# Altium project Humidity_Fan_Control.PrjPcb
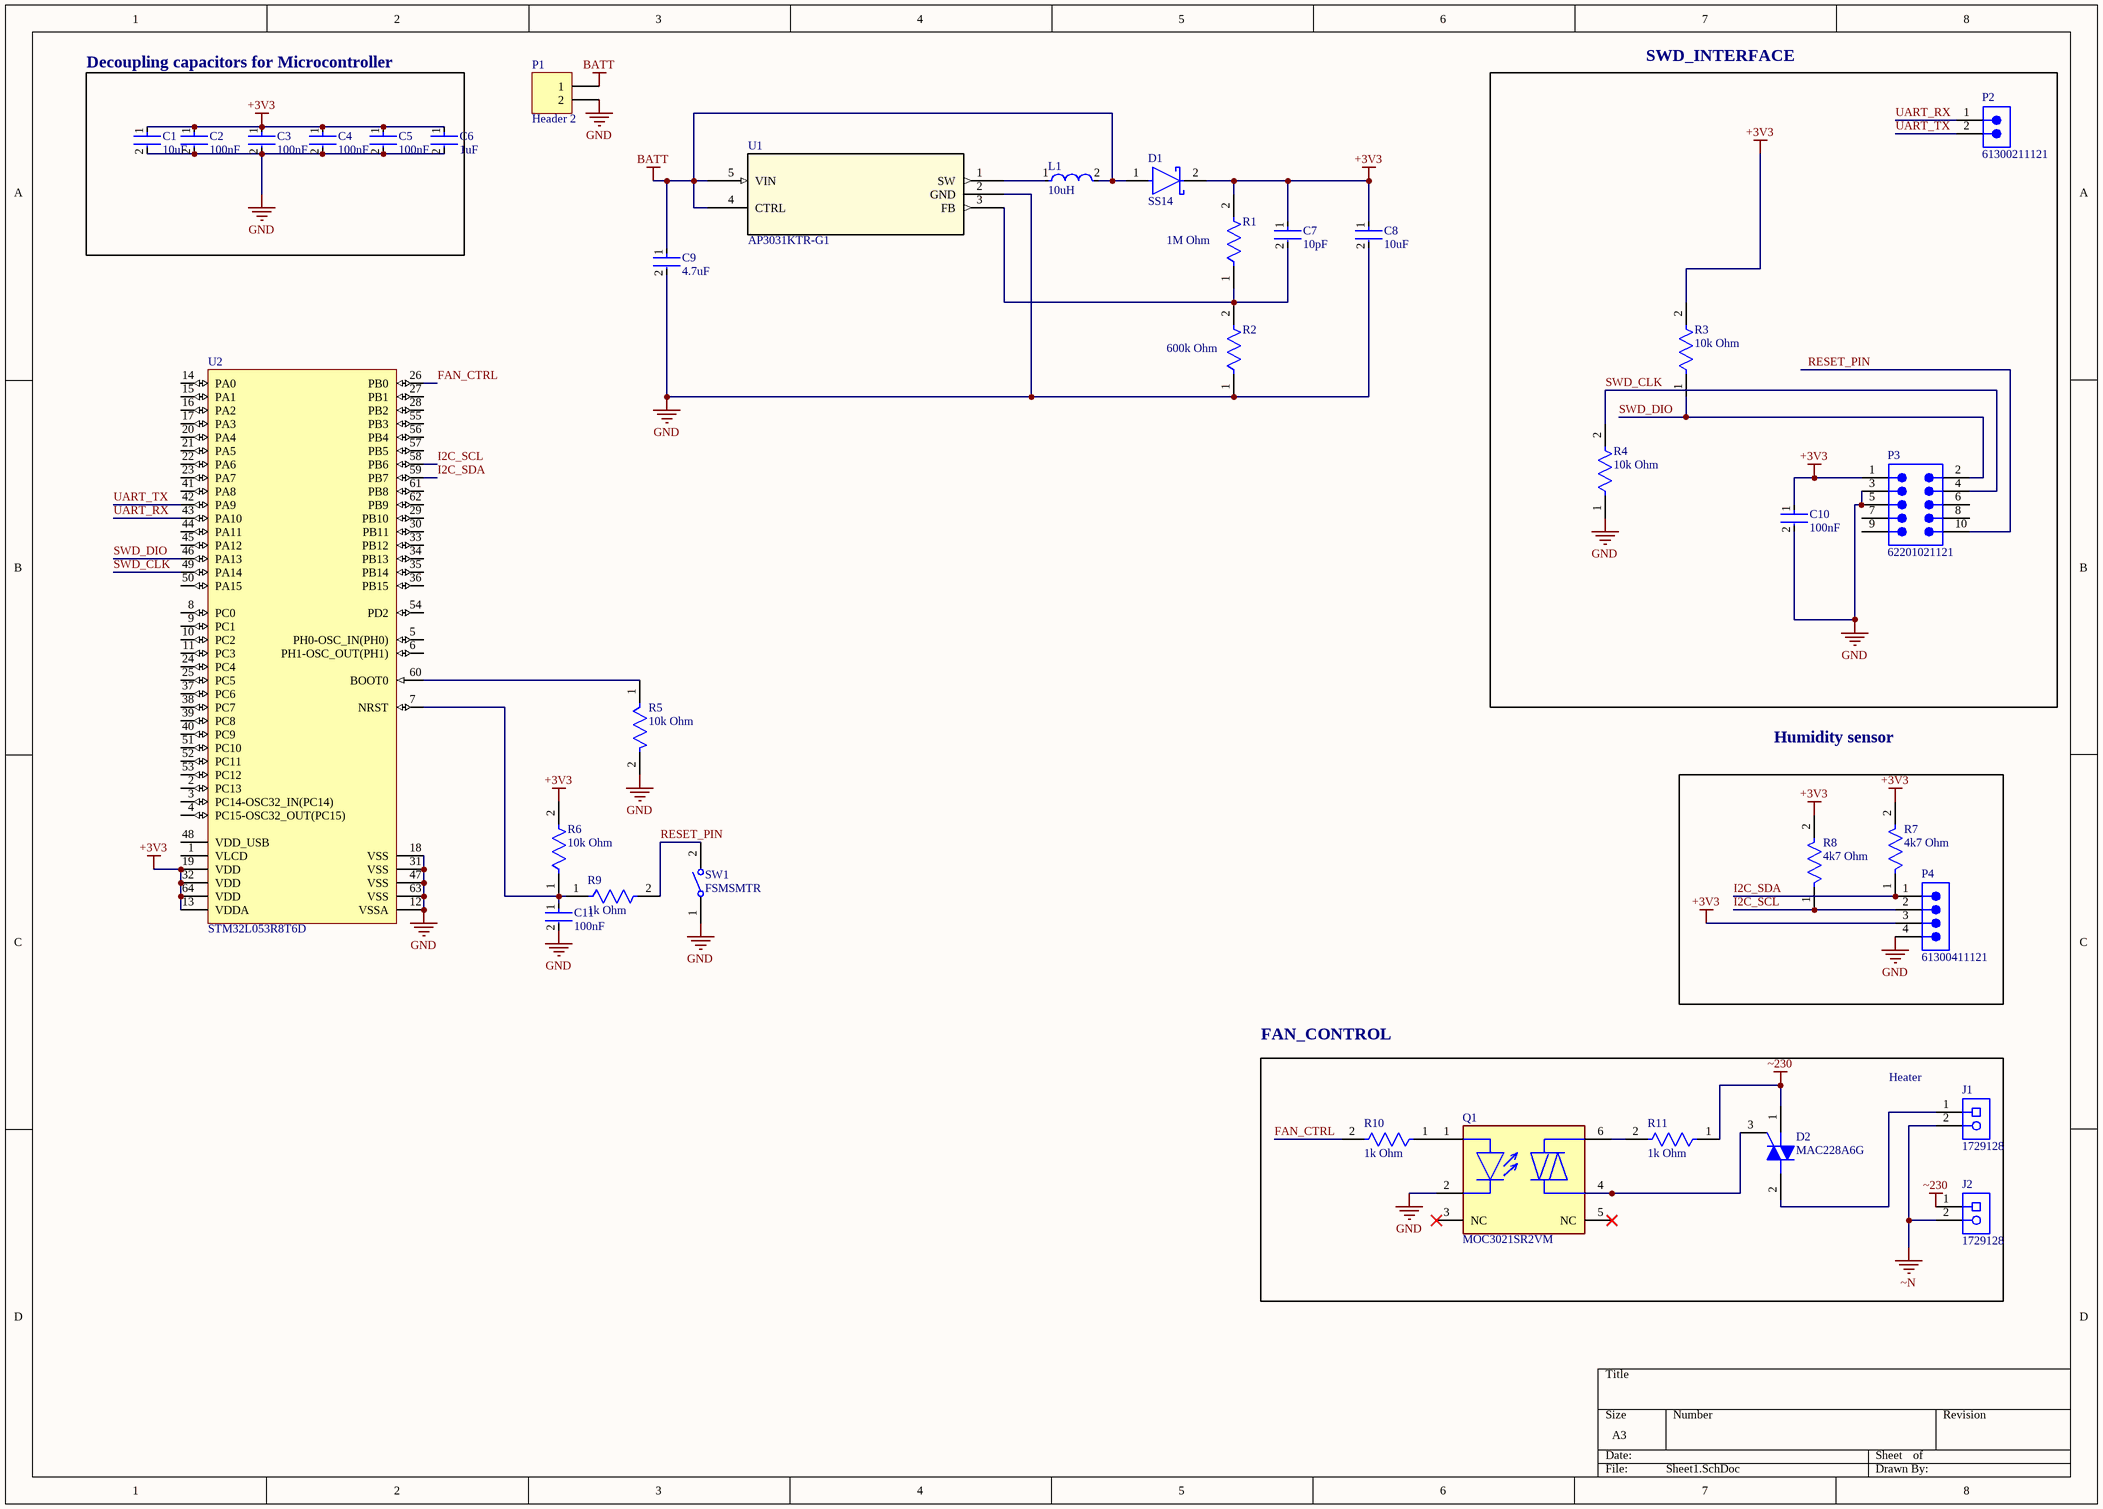
[diagram p0: Sheet1.SchDoc]
1 sheet, 35 parts. Net scope: global (net labels, ports and power ports of the same name join across sheets).
Board file: PCB2.PcbDoc

## Sheet Sheet1.SchDoc
size A3; SheetNumber: 1; SheetTotal: 1

### Parts
C1  10uF  [FP-CC0805-0_85-MFG]
C2  100nF  [FP-CC0805-0_85-MFG]
C3  100nF  [FP-CC0805-0_85-MFG]
C4  100nF  [FP-CC0805-0_85-MFG]
C5  100nF  [FP-CC0805-0_85-MFG]
C6  1uF  [FP-CC0805-0_85-MFG]
C7  10pF  [FP-CC0805-0_85-MFG]
C8  10uF  [FP-CC0805-0_85-MFG]
C9  4.7uF  [FP-CC0805-0_85-MFG]
C10  100nF  [FP-CC0805-0_85-MFG]
C11  100nF  [FP-CC0805-0_85-MFG]
D1  SS14  [FP-403AE-MFG]
D2  MAC228A6G  [ONSC-TO-220-3-221A-09]
J1  1729128  [PHOE-1729128-2_V]
J2  1729128  [PHOE-1729128-2_V]
L1  10uH  [FP-LQH43CN_03-MFG]
P1  Header 2  [HDR1X2]
P2  61300211121  [61300211121]
P3  62201021121  [62201021121]
P4  61300411121  [61300411121]
Q1  MOC3021SR2VM  [FP-646BY-MFG]
R1  1M Ohm  [FP-RMCF0805-MFG]
R2  600k Ohm  [FP-RMCF0805-MFG]
R3  10k Ohm  [FP-RMCF0805-MFG]
R4  10k Ohm  [FP-RMCF0805-MFG]
R5  10k Ohm  [FP-RMCF0805-MFG]
R6  10k Ohm  [FP-RMCF0805-MFG]
R7  4k7 Ohm  [FP-RMCF0805-MFG]
R8  4k7 Ohm  [FP-RMCF0805-MFG]
R9  1k Ohm  [FP-RMCF0805-MFG]
R10  1k Ohm  [FP-RMCF0805-MFG]
R11  1k Ohm  [FP-RMCF0805-MFG]
SW1  FSMSMTR  [TECO-FSMSMTR_V]
U1  AP3031KTR-G1  [SOT23-6_DIO]
U2  STM32L053R8T6D  [STM-LQFP64_L]

### Blocks framed on the sheet
Decoupling capacitors for Microcontroller: C1-C6
SWD_INTERFACE: C10 P2 P3 R3 R4
FAN_CONTROL: D2 J1 J2 Q1 R10 R11

### Nets
+3V3: C1.1 C2.1 C3.1 C4.1 C5.1 C6.1 C7.1 C8.1 C10.1 D1.2(C) P3.1 P4.3 R1.2 R3.2 R6.2 R7.2 R8.2 U2.13(VDDA) U2.19(VDD) U2.32(VDD) U2.64(VDD)
BATT: C9.1 D1.1(A) L1.2 P1.1 U1.4(CTRL) U1.5(VIN)
GND: C1.2 C2.2 C3.2 C4.2 C5.2 C6.2 C8.2 C9.2 C10.2 C11.2 P1.2 P3.3 P3.5 P4.4 Q1.2(C) R2.1 R4.1 R5.2 SW1.1 U1.2(GND) U2.12(VSSA) U2.18(VSS) U2.31(VSS) U2.47(VSS) U2.63(VSS)
~230: D2.1(MT1) J2.1 R11.1
~N: J1.2 J2.2
FAN_CTRL: R10.2 U2.26(PB0)
I2C_SCL: P4.2 R8.1 U2.58(PB6)
I2C_SDA: P4.1 R7.1 U2.59(PB7)
RESET_PIN: P3.10 R9.2 SW1.2
SWD_CLK: P3.4 R4.2 U2.49(PA14)
SWD_DIO: P3.2 R3.1 U2.46(PA13)
UART_RX: P2.1 U2.43(PA10)
UART_TX: P2.2 U2.42(PA9)
NetC7_2: C7.2 R1.1 R2.2 U1.3(FB)
NetC11_1: C11.1 R6.1 R9.1 U2.7(NRST)
NetD2_2: D2.2(MT2) J1.1
NetD2_3: D2.3(G) Q1.4(1_MAIN_TERM)
NetL1_1: L1.1 U1.1(SW)
NetQ1_1: Q1.1(A) R10.1
NetQ1_6: Q1.6(2_MAIN_TERM) R11.2
NetR5_1: R5.1 U2.60(BOOT0)

Not connected (* = marked no-connect by the designer): P3 6 7 8 9; Q1 3(NC)* 5(NC)*; U2 1(VLCD) 2(PC13) 3(PC14-OSC32_IN(PC14)) 4(PC15-OSC32_OUT(PC15)) 5(PH0-OSC_IN(PH0)) 6(PH1-OSC_OUT(PH1)) 8(PC0) 9(PC1) 10(PC2) 11(PC3) 14(PA0) 15(PA1) 16(PA2) 17(PA3) 20(PA4) 21(PA5) 22(PA6) 23(PA7) 24(PC4) 25(PC5) 27(PB1) 28(PB2) 29(PB10) 30(PB11) 33(PB12) 34(PB13) 35(PB14) 36(PB15) 37(PC6) 38(PC7) 39(PC8) 40(PC9) 41(PA8) 44(PA11) 45(PA12) 48(VDD_USB) 50(PA15) 51(PC10) 52(PC11) 53(PC12) 54(PD2) 55(PB3) 56(PB4) 57(PB5) 61(PB8) 62(PB9)

### Notes on the sheet
- Humidity sensor
- (near J1) Heater

### Library data of the parts
C1 C6-C9 = CMP-2100-03606-3: CAP CER 0.1UF 50V X7R 0805; Manufacturer Part Number: CC0805KRX7R9BB104; Manufacturer: Yageo; Tolerance: 0.1; Capacitance: 100 nF; Value: 100 nF; Material: Ceramic; Device Class L1: Passive Components; ComponentLink2Description: Datasheet; Package: CC0805-0.85; Digikey Description: CAP CER 0.1UF 50V X7R 0805; Device Class L3: Ceramic Capacitors; Temperature: -30°C to +85°C; Temperature Characteristic: X7R; Voltage Rating: 50 V; Height: 0.95mm; RoHS: TRUE; Ipc Land Pattern Name: CAPC200125X85; Device Class L2: Capacitors; Category: Cap; Temperature Range Low: -30°C; Temperature Range High: +85°C; Mouser Description: Multilayer Ceramic Capacitors MLCC - SMD/SMT 100nF 50V X7R 10%; Footprint Url: http://www.yageo.com/exep/pages/download/literatures/UPY-C_GEN_24.pdf; Automotive: No; Octopart: https://octopart.com/cc0805krx7r9bb104-yageo-192993; Lead Free: Yes; ComponentLink2URL: http://www.yageo.com/documents/recent/UPY-GPHC_Y5V_6.3V-to-50V_8.pdf
C2-C5 C10 C11 = CMP-2100-03606-3: CAP CER 0.1UF 50V X7R 0805; Manufacturer Part Number: CC0805KRX7R9BB104; Manufacturer: Yageo; Tolerance: 0.1; Material: Ceramic; Device Class L1: Passive Components; ComponentLink2Description: Datasheet; Package: CC0805-0.85; Digikey Description: CAP CER 0.1UF 50V X7R 0805; Capacitance: 100 nF; Device Class L3: Ceramic Capacitors; Value: 100 nF; Temperature: -30°C to +85°C; Temperature Characteristic: X7R; Voltage Rating: 50 V; Height: 0.95mm; RoHS: TRUE; Ipc Land Pattern Name: CAPC200125X85; Device Class L2: Capacitors; Category: Cap; Temperature Range Low: -30°C; Temperature Range High: +85°C; Mouser Description: Multilayer Ceramic Capacitors MLCC - SMD/SMT 100nF 50V X7R 10%; Footprint Url: http://www.yageo.com/exep/pages/download/literatures/UPY-C_GEN_24.pdf; Automotive: No; Octopart: https://octopart.com/cc0805krx7r9bb104-yageo-192993; Lead Free: Yes; ComponentLink2URL: http://www.yageo.com/documents/recent/UPY-GPHC_Y5V_6.3V-to-50V_8.pdf
D1 = CMP-2000-04943-2: DIODE SCHOTTKY 40V 1A SMA; Manufacturer: ON Semiconductor; Description: ON SEMICONDUCTOR - - DIODE, SCHOTTKY, 1A, 40V, DO-214AC-2; Peak Reverse Current: 0.2mA; Max Junction Temp: +125°C; Standoff Height: 0.05mm; Max Surge Forward Current: 40A; Mouser Description: Schottky Diodes & Rectifiers SMA 40V 1.0A; RoHS: TRUE; Lead Free: Yes; Manufacturer Part Number: SS14; Device Class L3: Schottky Diodes; Category: Diode; Automotive: No; Digikey Description: DIODE SCHOTTKY 40V 1A SMA; ComponentLink2Description: Datasheet; Device Class L2: Diodes; Height: 2.5mm; Temperature Range High: +125°C; ComponentLink2URL: https://www.onsemi.com/pub/Collateral/SS19-D.PDF; Device Class L1: Discrete Semiconductors; Package: 403AE; Octopart: https://octopart.com/ss14-on+semiconductor-29205033; Max Repetitive Reverse Voltage: 40V; Temperature Range Low: -65°C; Forward Current: 1A; Temperature: -65°C to +125°C
D2 = CMP-1070-00099-1: Sensitive Gate Triacs, Silicon Bidirectional Thyristor, 3-Pin TO-220, Pb-Free, Bulk Box; Manufacturer: On Semiconductor; ITSM Max (A): 80; IT(RMS) Max (A): 8; DatasheetVersion: Rev. 7; ComponentLink2Description: Datasheet; PackageDescription: 3-Pin Flange Mount, Vertical Straight Lead, Body 9.97 x 4.445 mm, Pitch 2.54 mm; Packing: Bulk Box; ComponentLink3Description: Package Specification; RoHS: Pb-Free; ComponentLink2URL: http://www.onsemi.com/pub_link/Collateral/MAC228A-D.PDF; PartNumber: MAC228A6G; ComponentLink3URL: http://www.onsemi.com/pub_link/Collateral/221A-09.PDF; ComponentLink1URL: http://www.onsemi.com/; PackageVersion: Rev. AG, 09/2011; PackageReference: TO-220-3-221A-09; ComponentLink1Description: Manufacturer URL; Mounting Technology: Through Hole
J1 J2 = CMP-2000-05815-1: PCB Terminal Block, 13.5 A, 400 V, 2-Pin THD, RoHS, Bulk; Manufacturer: Phoenix Contact; Package Version: 03/2015; No. of Rows: 1; Pitch: 5.08mm; No. of Positions: 2; Voltage Rating: 400V; Current Rating: 13500mA; Manufacturer URL: http://www.phoenixcontact.com/; Datasheet URL: https://datasheet.ciiva.com/16046/1729128-16046181.pdf; RoHS: TRUE; Package URL: https://www.phoenixcontact.com/online/portal/pi/pxc/product_detail_page/!ut/p/b1/3VdJjqNKFDxLH8AFycySyWY2ozFsEPOMMQaDOX1XedGL_1Vdm5YXJleknhSKeBkvI6EA8ncAo3AYoDhBQGco6KN7VURTdemj9us_IEKEZo_YHiPAEWEFmDGOHMORkqKYCORBZxgL7ZoaZYcbFFUZ3fqxSY6GOuxydWUuHqz1ynmMFygu583Bob0Ewr6Sd_l-5m-kAueHiB0jpRwZwe58wwtkpxtMYd_LmGcDRU02dRNEyWt6Y2ti5pSyJ_reIkzIulrqApdnbT11V5jnCKbYNCvhEM1MCpPByat_X379-iThf08CI5GfOPqfBeS3BRoBOdD55AKVv0iLwCMq-2BrzXWSGRH7pUGD9uwXQjiph3xL0DKQwdGa0JImiIOmBNOestqgwTHSSs2oOep-78apyXQBvNi8ZLaFjvjWvcaUEBu0MC6Wbe-d6mB0FAebo2lUWinqYaZs5DAYzV0RP9yitUjnGJ0iI9xhZkT42OCQNUJJhkgWINNQLP2JFP6OpMg3JCVg70jqHT0lvKOnhHf0lPuOnnLf0VPuWx6_dxwUIvwk5WMkT0kLL1mh61l2yZVSzG3pYV_bqo-mj6uMKwKwdnnW8Jh5RTOJzMOA5c-eJDaZQw4mTMPH02PvS_ZAqNVjVTo2WyYLkwH_KU1mmmG5kjRhDqPXLwwVHvVOjCM60-fpXvTDfMGW1PVFVS1r4e4yVDk4ZdNbkUHvqPqQSeian4UD39fNKmachqdJ1NJbyk8rXT9mXTvPk3oE5meulKGgiruPJek-4I9hTT6G8ZLOyRSm2RRVbThERQad5OS28hdt4YW4vG0stgYYzsWsK4_7y6DZMjJSCqri1kyiZR5vD7pwIrNR7QwPHTcLTI5qT7eRlpHrdGiupYlqQDJ7zy_CND8fWWBoLRXxk1RVcXiBQwbTD4Xi7KL-FuO94t9xaqweXzH; PartNumber: 1729128; Package Description: 2-Pin Through Hole Device, Body 8.1 x 10.16 mm, Pitch 5.08 mm; Datasheet Version: 12/2013; Mounting Technology: ThroughHole; Orientation: Horizontal; Package Reference: 1729128-2; Packing: Bulk
L1 = CMP-06042-007054-1: Wire Wound Ferrite Inductor for General Circuits 470μH ±10% 11.8Ω 80mA 1812; Q Factor: 40; Self Resonant Frequency: 3MHz; Shielding: Unshielded; Inductance: 470uH; Test Frequency: 1kHz; Series Resistance: 11.8R; Core Material: Ferrite; Tolerance: 10%; Weight: 0.004586oz; Width: 3.2mm; Case/Package: 1812; Military Standard: Not; Resistor Type: Wirewound; Max Operating Temperature: 85°C; Lead Free: Lead Free; Packaging: Tape and Reel; Termination: SMD/SMT; Case Code (Imperial): 1812; Length: 4.5mm; Height - Seated (Max): 0.11inch; Height: 2.6mm; Min Operating Temperature: -40°C; Max DC Current: 80mA; Radiation Hardening: No; Frequency: 3MHz; Package Quantity: 500; Mount: Surface Mount; Case Code (Metric): 4532; DC Current: 80mA; DC Resistance (DCR): 11.8R; Current Rating: 80mA; Depth: 3.4mm
P1 = Header 2: Header, 2-Pin; LatestRevisionDate: 17-Jul-2002; LatestRevisionNote: Re-released for DXP Platform.; Publisher: Altium Limited
P2 = CMP-1712-00002-6: NexarPartId: 20081794; Number of Contacts: 2; Pitch: 2.54mm; Connector Type: Male Pin; Voltage Rating: 250V; Current Rating: 3A; Gender: Male; Contact Resistance: 20mΩ; Height: 8.94mm; Lead Free: Lead Free; Number of Pins: 2; Termination: Through Hole; RoHS: Compliant; Lead Pitch: 2.54mm; REACH SVHC: No SVHC; Housing Material: PBT; Contact Mating Length: 5.9944mm; Min Operating Temperature: -40°C; Orientation: Vertical; Contact Material: Copper; Contact Gender: Male; Max Operating Temperature: 125°C; Number of Rows: 1; Number of Positions: 2; Packaging: Bulk; Contact Plating: Gold; Mount: Through Hole; Color: Black; Operating Supply Voltage: 250V
P3 = CMP-1502-00948-3: NexarPartId: 32855586; Pitch: 1.27mm; Operating Supply Voltage: 100V; Connector Type: Male Pin; Contact Resistance: 20mΩ; Current Rating: 1A; Number of Contacts: 10; Gender: Male; Contact Mating Length: 3.81mm; Max Operating Temperature: 105°C; Mount: Through Hole; Number of Pins: 10; Row Spacing: 1.27mm; Lead Pitch: 1.27mm; REACH SVHC: Unknown; Min Operating Temperature: -40°C; Contact Material: Copper; Orientation: Vertical; Contact Plating: Gold; Number of Rows: 2; RoHS: Compliant; Packaging: Box; Voltage Rating: 100V; Color: Black; Height: 5.65mm; Termination: Solder; Number of Positions: 10
P4 = CMP-1502-01064-3: NexarPartId: 32855522; Operating Supply Voltage: 250V; Pitch: 2.54mm; Contact Resistance: 20mΩ; Number of Positions: 4; Current Rating: 3A; Connector Type: Male Pin; Gender: Male; Contact Plating: Gold; Height: 8.89mm; Lead Pitch: 2.54mm; Lead Free: Lead Free; Contact Mating Length: 5.9944mm; Number of Rows: 1; Termination: Solder; Packaging: Bulk; REACH SVHC: Unknown; Min Operating Temperature: -40°C; RoHS: Compliant; Number of Contacts: 4; Voltage Rating: 250V; Color: Black; Max Operating Temperature: 105°C; Contact Material: Copper; Mount: Through Hole; Orientation: Vertical; Number of Pins: 4
Q1 = CMP-00278-84330366-1: MOC3021SR2VM Triac Driver Output Optocoupler, 6-Pin DIP 400V Random Phase; Manufacturer Lifecycle Status: ACTIVE; Isolation Voltage: 7.5kV; Power Dissipation: 330mW; Hold Current: 100µA; Number of Circuits: 1; Approvals: EN, IEC, UL; Input Current: 60mA; Nominal Input Voltage: 1.15V; Reverse Breakdown Voltage: 3V; Max Input Voltage: 1.5V; Max Operating Temperature: 85°C; Weight: 810mg; Mount: Surface Mount; REACH SVHC: No SVHC; Case/Package: SMD/SMT; NexarPartId: 84330366; RoHS: Compliant; Lead Free: Lead Free; Schedule B: 8541408000, 8541408000; Number of Elements: 1; Number of Channels: 1; Packaging: Digi-Reel®; Forward Voltage: 1.15V; Forward Current: 60mA; Number of Pins: 6; Radiation Hardening: No; Output Voltage: 400V; Max Power Dissipation: 330mW; Lifecycle Status: Production; Min Operating Temperature: -40°C
R1-R11 = CMP-26527-000017-1: RES 0 OHM JUMPER 1/8W 0805; Power Rating: 125mW; Resistance: 0mR; Depth: 1.25mm; Length: 2mm; Military Standard: Not; Width: 0.049inch; Case Code (Imperial): 0805; Number of Terminations: 2; Mount: Surface Mount; Contact Plating: Tin; Height: 0.026inch; Case/Package: 0805; Min Operating Temperature: -55°C; Composition: Thick Film; Max Operating Temperature: 155°C; Packaging: Tape and Reel; Features: Automotive AEC-Q200; Max Power Dissipation: 125mW; Radiation Hardening: No; Lead Free: Lead Free; Case Code (Metric): 2012
SW1 = CMP-2000-07501-1: FSMSM Push Button Switch, 50 mA, -35 to 85 degC, 2-Pin SMD, RoHS, Tape and Reel; Manufacturer: TE Connectivity; Voltage Rating (DC): 24V; Electrical Life: 20000Cycles; Operating Force: 180gf; Switch Travel: 0.25mm; Contact Current Rating: 50mA; Case\/Package: SMD/SMT; Actuator Length: 1.07mm; Throw Configuration: SPST; Actuator Material: Polyamide; Contact Resistance: 100mOhm; Illumination Type: Illuminated; Max Voltage Rating (DC): 12V; Manufacturer URL: http://www.te.com/; Lead Free: LeadFree; Packaging: TapeandReel; Min Operating Temperature: -35degC; Mechanical Life: 20000Cycles; Mount: SurfaceMount; REACH SVHC: Unknown; Package Quantity: 1800; Package Reference: FSMSMTR; RoHSCompliant: true; Max Operating Temperature: 85degC; Orientation: Straight; ELV: Compliant; Datasheet URL: http://www.te.com/commerce/DocumentDelivery/DDEController?Action=showdoc&DocId=Customer+Drawing%7F1437566-3%7FC2%7Fpdf%7FEnglish%7FENG_CD_1437566-3_C2_1437566_3_1_c.dwg.pdf%7F1437566-4; Package Description: 2-Pin Surface Mount Device, Body 6 x 3.5 mm, Pitch 9.19 mm; Current Rating: 50mA; Contact Plating: Silver; Termination: GullWing; Datasheet Version: Rev. C2, 08/2014; Contact Material: Brass; Mounting Technology: SurfaceMount
U1 = AP3031KTR-G1: No Description Available; Mfr_Name: Diodes Inc; RefDes: RefDes; Type: Type
U2 = CMP-1546-00063-2: Ultra-low-power 32-Bit MCU ARM-based Cortex-M0+, 64 KB Flash, 8 KB RAM, 51 I/Os, 64-Pin LQFP, -40 to 85 degC, Tray; I/Os (High Current): 51; Core: ARM Cortex-M0+; FLASH Size (Prog) (kB): 64; Internal RAM Size (kB): 8; D/A Converter: 1; Operating Frequency(F) (Processor speed) (MHz): 32; Supply Voltage(Vcc) min (V): 1.65; Data E2PROM nom (B): 2048; Package Description: 64-Pin Low-profile Quad Flat Package, Body 10 x 10 mm, Pitch 0.5 mm; ComponentLink2URL: http://www.st.com/st-web-ui/static/active/en/resource/technical/document/datasheet/DM00105960.pdf; Package Reference: LQFP64; ComponentLink1URL: http://www.st.com/; Packing: Tray; ComponentLink1Description: Manufacturer URL; ComponentLink2Description: Datasheet; DatasheetVersion: Rev. 5; Mounting Technology: Surface Mount